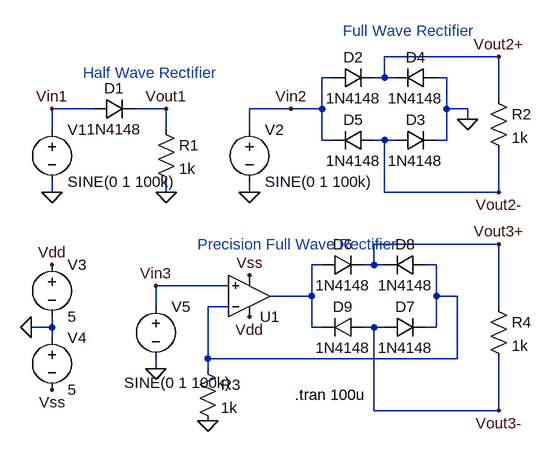
[diagram p0: schematic Rectifiers.asc]
Rectifiers.asc, the LTspice schematic file:
Version 4
SHEET 1 880 680
WIRE 784 16 608 16
WIRE 528 48 512 48
WIRE 608 48 608 16
WIRE 608 48 592 48
WIRE 624 48 608 48
WIRE 704 48 688 48
WIRE 784 80 784 16
WIRE 160 96 96 96
WIRE 272 96 224 96
WIRE 464 96 400 96
WIRE 512 96 512 48
WIRE 512 96 464 96
WIRE 704 96 704 48
WIRE 736 96 704 96
WIRE 736 112 736 96
WIRE 96 128 96 96
WIRE 272 128 272 96
WIRE 400 128 400 96
WIRE 512 144 512 96
WIRE 528 144 512 144
WIRE 608 144 592 144
WIRE 624 144 608 144
WIRE 704 144 704 96
WIRE 704 144 688 144
WIRE 96 224 96 208
WIRE 272 224 272 208
WIRE 400 224 400 208
WIRE 608 224 608 144
WIRE 784 224 784 160
WIRE 784 224 608 224
WIRE 784 304 592 304
WIRE 512 336 496 336
WIRE 592 336 592 304
WIRE 592 336 576 336
WIRE 608 336 592 336
WIRE 688 336 672 336
WIRE 368 368 256 368
WIRE 496 384 496 336
WIRE 496 384 432 384
WIRE 688 384 688 336
WIRE 720 384 688 384
WIRE 256 400 256 368
WIRE 368 400 336 400
WIRE 784 400 784 304
WIRE 96 432 96 416
WIRE 96 432 64 432
WIRE 496 432 496 384
WIRE 512 432 496 432
WIRE 592 432 576 432
WIRE 608 432 592 432
WIRE 688 432 688 384
WIRE 688 432 672 432
WIRE 96 448 96 432
WIRE 336 480 336 400
WIRE 720 480 720 384
WIRE 720 480 336 480
WIRE 256 496 256 480
WIRE 336 496 336 480
WIRE 592 560 592 432
WIRE 784 560 784 480
WIRE 784 560 592 560
FLAG 96 224 0
FLAG 272 224 0
FLAG 96 96 Vin1
FLAG 272 96 Vout1
FLAG 400 224 0
FLAG 736 112 0
FLAG 464 96 Vin2
FLAG 784 16 Vout2+
FLAG 784 224 Vout2-
FLAG 64 432 0
FLAG 96 336 Vdd
FLAG 96 528 Vss
FLAG 256 496 0
FLAG 256 368 Vin3
FLAG 400 416 Vdd
FLAG 400 352 Vss
FLAG 336 576 0
FLAG 784 304 Vout3+
FLAG 784 560 Vout3-
SYMBOL voltage 96 112 R0
WINDOW 123 0 0 Left 2
WINDOW 39 0 0 Left 2
SYMATTR InstName V1
SYMATTR Value SINE(0 1 100k)
SYMBOL diode 160 80 M90
WINDOW 0 0 32 VBottom 2
WINDOW 3 32 32 VTop 2
SYMATTR InstName D1
SYMATTR Value 1N4148
SYMBOL res 256 112 R0
SYMATTR InstName R1
SYMATTR Value 1k
SYMBOL voltage 400 112 R0
WINDOW 123 0 0 Left 2
WINDOW 39 0 0 Left 2
SYMATTR InstName V2
SYMATTR Value SINE(0 1 100k)
SYMBOL diode 528 64 R270
WINDOW 0 32 32 VTop 2
WINDOW 3 0 32 VBottom 2
SYMATTR InstName D2
SYMATTR Value 1N4148
SYMBOL diode 624 160 R270
WINDOW 0 32 32 VTop 2
WINDOW 3 0 32 VBottom 2
SYMATTR InstName D3
SYMATTR Value 1N4148
SYMBOL diode 688 32 R90
WINDOW 0 0 32 VBottom 2
WINDOW 3 32 32 VTop 2
SYMATTR InstName D4
SYMATTR Value 1N4148
SYMBOL diode 592 128 R90
WINDOW 0 0 32 VBottom 2
WINDOW 3 32 32 VTop 2
SYMATTR InstName D5
SYMATTR Value 1N4148
SYMBOL res 768 64 R0
SYMATTR InstName R2
SYMATTR Value 1k
SYMBOL voltage 96 320 R0
WINDOW 123 0 0 Left 2
WINDOW 39 0 0 Left 2
SYMATTR InstName V3
SYMATTR Value 5
SYMBOL voltage 96 432 R0
WINDOW 123 0 0 Left 2
WINDOW 39 0 0 Left 2
SYMATTR InstName V4
SYMATTR Value 5
SYMBOL voltage 256 384 R0
WINDOW 3 -49 133 Left 2
WINDOW 123 0 0 Left 2
WINDOW 39 0 0 Left 2
SYMATTR InstName V5
SYMATTR Value SINE(0 1 100k)
SYMBOL diode 512 352 R270
WINDOW 0 32 32 VTop 2
WINDOW 3 0 32 VBottom 2
SYMATTR InstName D6
SYMATTR Value 1N4148
SYMBOL diode 608 448 R270
WINDOW 0 32 32 VTop 2
WINDOW 3 0 32 VBottom 2
SYMATTR InstName D7
SYMATTR Value 1N4148
SYMBOL diode 672 320 R90
WINDOW 0 0 32 VBottom 2
WINDOW 3 32 32 VTop 2
SYMATTR InstName D8
SYMATTR Value 1N4148
SYMBOL diode 576 416 R90
WINDOW 0 0 32 VBottom 2
WINDOW 3 32 32 VTop 2
SYMATTR InstName D9
SYMATTR Value 1N4148
SYMBOL Opamps\\UniversalOpamp2 400 384 M180
SYMATTR InstName U1
SYMBOL res 320 480 R0
SYMATTR InstName R3
SYMATTR Value 1k
SYMBOL res 768 384 R0
SYMATTR InstName R4
SYMATTR Value 1k
TEXT 470 536 Left 2 !.tran 100u
TEXT 144 40 Left 2 ;Half Wave Rectifier
TEXT 544 -24 Left 2 ;Full Wave Rectifier
TEXT 320 304 Left 2 ;Precision Full Wave Rectifier

The netlist it stands for:
* Rectifiers.asc
V1 Vin1 0 SINE(0 1 100k)
D1 Vin1 Vout1 1N4148
R1 Vout1 0 1k
V2 Vin2 0 SINE(0 1 100k)
D2 Vin2 Vout2+ 1N4148
D3 Vout2- 0 1N4148
D4 0 Vout2+ 1N4148
D5 Vout2- Vin2 1N4148
R2 Vout2+ Vout2- 1k
V3 Vdd 0 5
V4 0 Vss 5
V5 Vin3 0 SINE(0 1 100k)
D6 N001 Vout3+ 1N4148
D7 Vout3- N002 1N4148
D8 N002 Vout3+ 1N4148
D9 Vout3- N001 1N4148
XU1 Vin3 N002 Vdd Vss N001 level.2 Avol=1Meg GBW=10Meg Slew=10Meg ilimit=25m rail=0 Vos=0 phimargin=45 en=0 enk=0 in=0 ink=0 Rin=500Meg  ; pins IN+ IN- V+ V- OUT
R3 N002 0 1k
R4 Vout3+ Vout3- 1k
.model D D
.lib standard.dio
.tran 100u
* Half Wave Rectifier
* Full Wave Rectifier
* Precision Full Wave Rectifier
.lib UniversalOpamps2.sub
.backanno
.end